# EasyEDA schematic SCH_Endurance_drone_5.json
TITLE: Drone main PCB (No MUX); REV: 2; Date: 2021-11-16; Sheet: 1/1; Company: Endurance
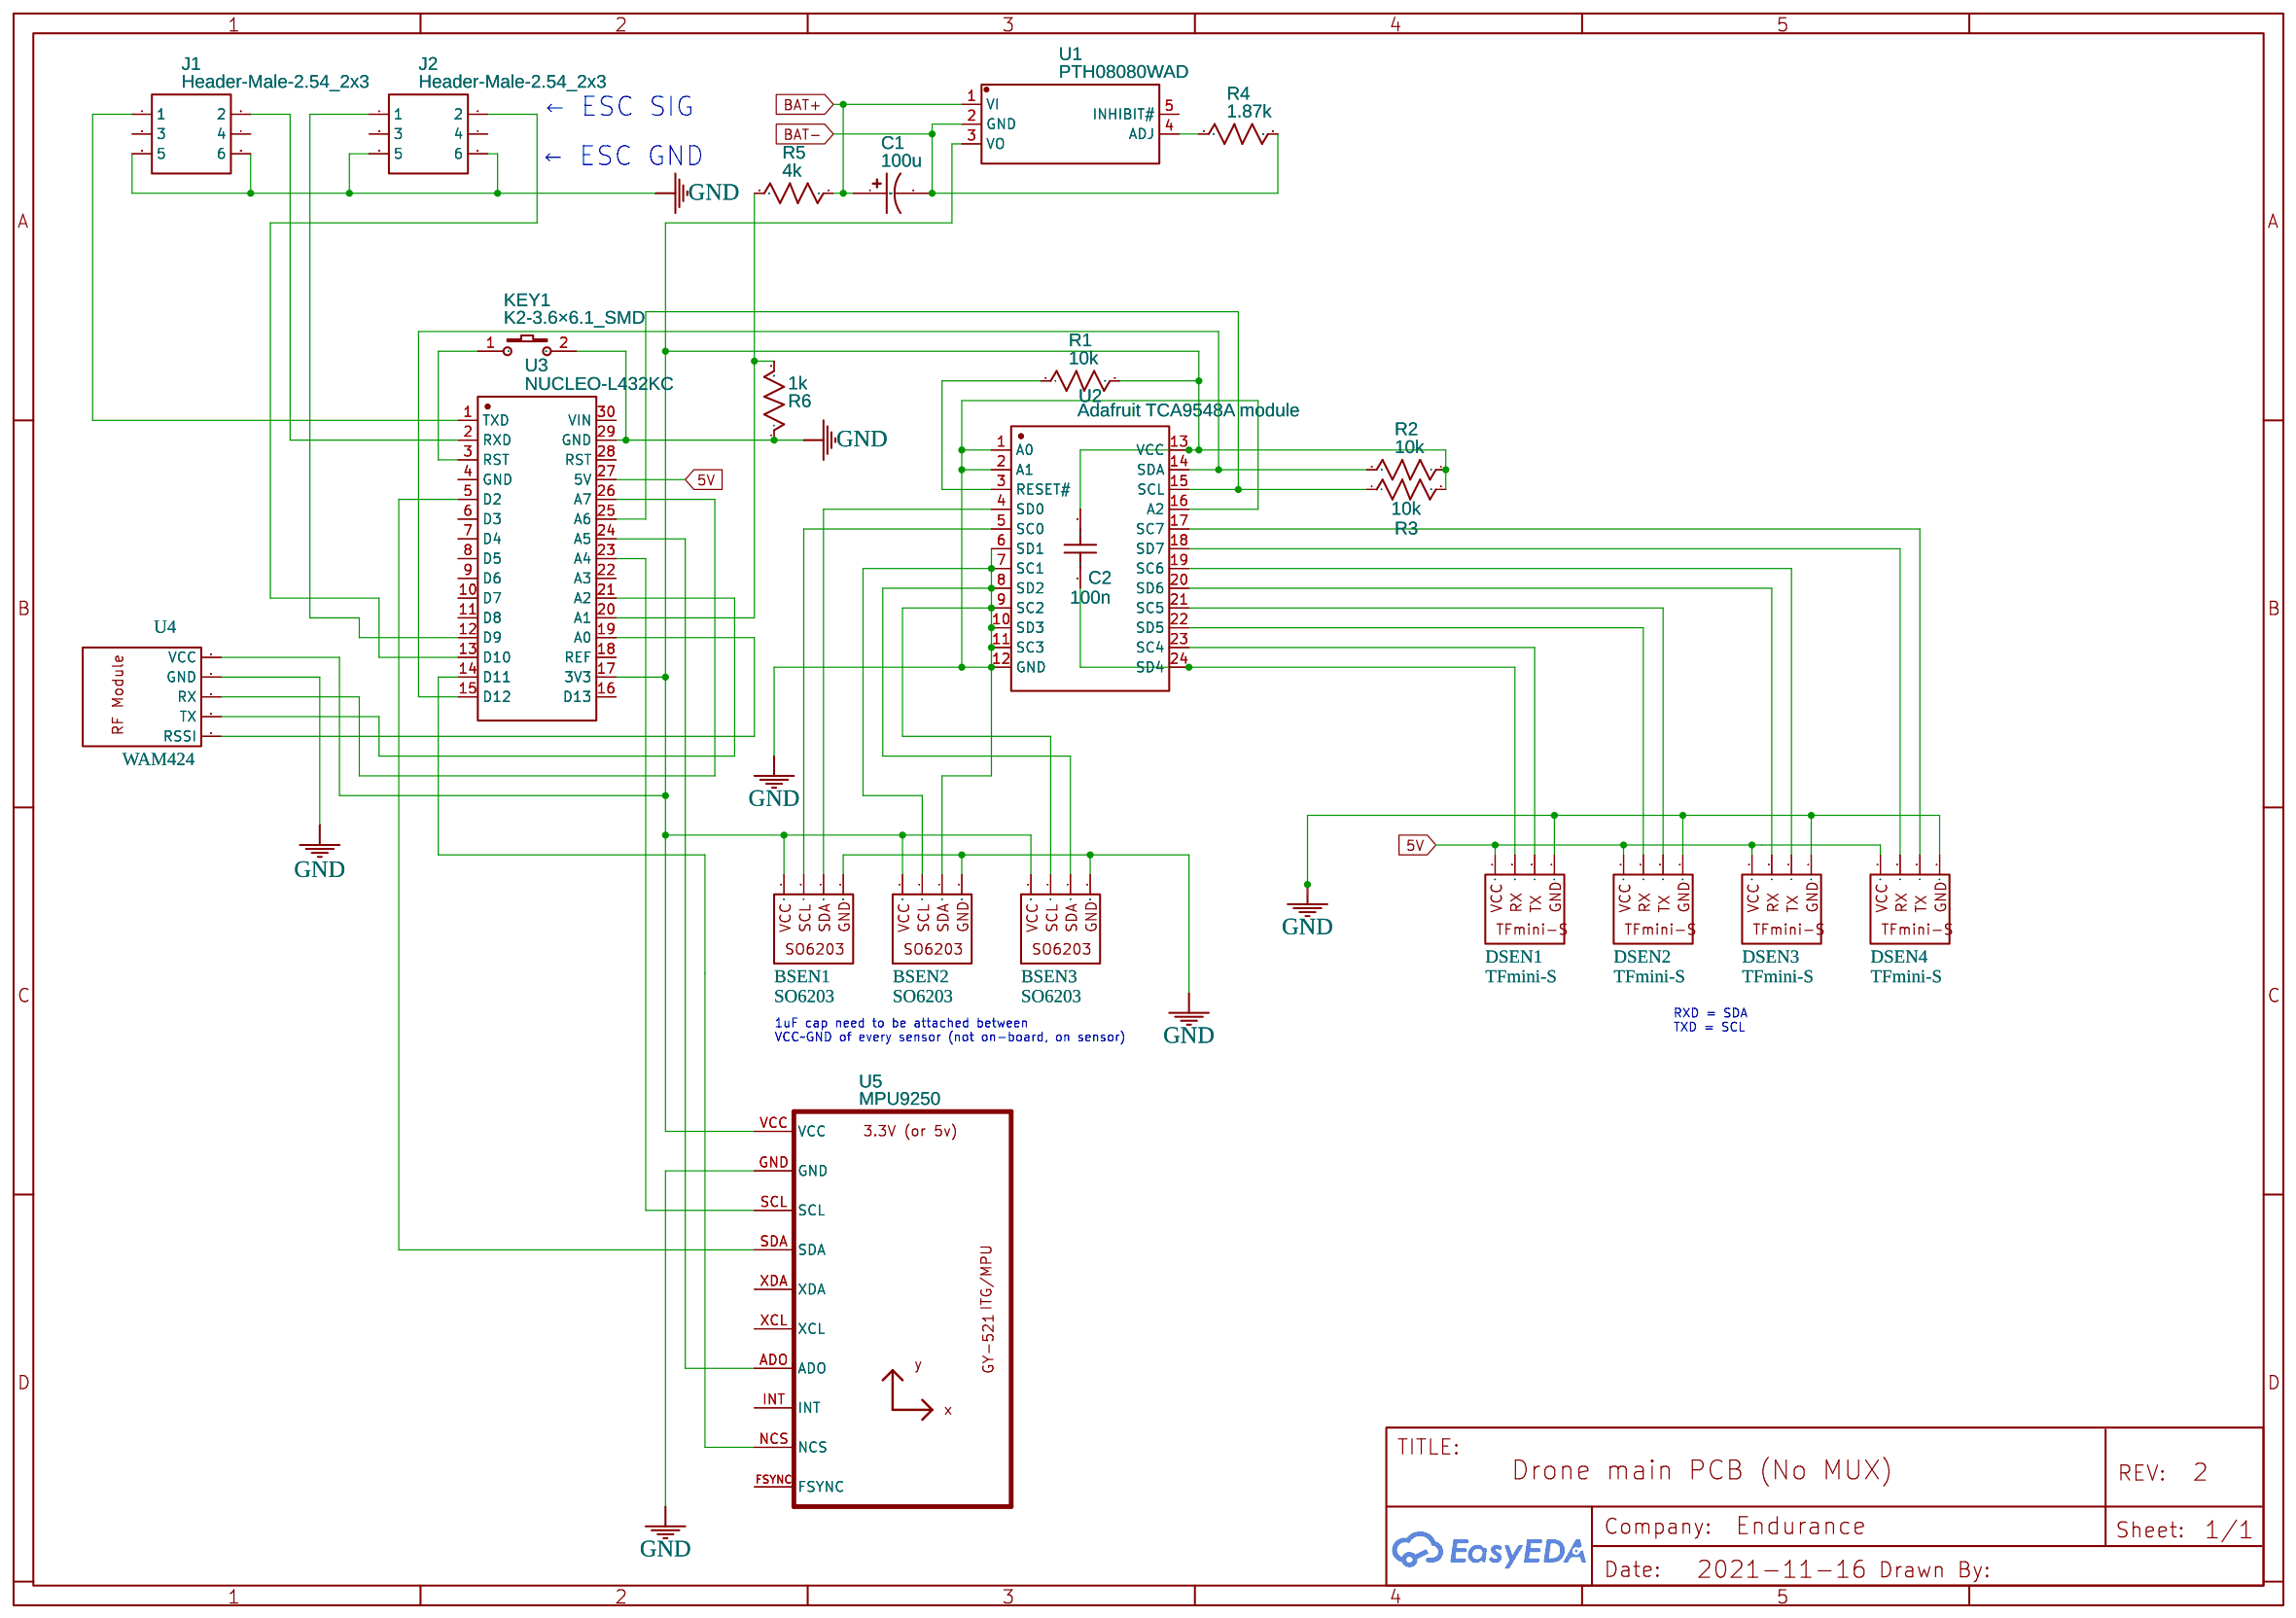
[diagram p0: schematic sheet]

## Parts
BSEN1  SO6203  [MOLEX_SPOX-5267_22-03-5045_04X2.54MM_STRAIGHT]
BSEN2  SO6203  [MOLEX_SPOX-5267_22-03-5045_04X2.54MM_STRAIGHT]
BSEN3  SO6203  [MOLEX_SPOX-5267_22-03-5045_04X2.54MM_STRAIGHT]
C1  100u  [CASE-A_3216]
C2  100n  [C0603]
DSEN1  TFmini-S  [MOLEX_SPOX-5267_22-03-5045_04X2.54MM_STRAIGHT]
DSEN2  TFmini-S  [MOLEX_SPOX-5267_22-03-5045_04X2.54MM_STRAIGHT]
DSEN3  TFmini-S  [MOLEX_SPOX-5267_22-03-5045_04X2.54MM_STRAIGHT]
DSEN4  TFmini-S  [MOLEX_SPOX-5267_22-03-5045_04X2.54MM_STRAIGHT]
J1  Header-Male-2.54_2x3  [HDR-TH_6P-P2.54-V-M-R2-C3-S2.54-1]
J2  Header-Male-2.54_2x3  [HDR-TH_6P-P2.54-V-M-R2-C3-S2.54-1]
KEY1  K2-3.6×6.1_SMD  [KEY-SMD_2P-L6.2-W3.6-LS8.0]
R1  10k  [R0603]
R2  10k  [R0603]
R3  10k  [R0603]
R4  1.87k  [R0805]
R5  4k  [R0603]
R6  1k  [R0603]
U1  PTH08080WAD  [PWRM-TH_5P-L16.3-W13.7-P3.56]
U2  Adafruit TCA9548A module  [TCA9548A]
U3  NUCLEO-L432KC  [DIP-30_L51.0-W17.8-P2.54-LS15.2-TL]
U4  WAM424  [MOLEX_SPOX-5267_22-03-5045_04X2.54MM_STRAIGHT]
U5  MPU9250  [GY-521]

## Library data of the parts
C1 = C_Tan_SMD_A_US: Contributor: LCEDA_Lib
C2 = C_0603_US: Contributor: LCEDA_Lib
J1 J2 = Header-Male-2.54_2x3: Supplier: LCSC; Manufacturer: BOOMELE; Supplier Part: C65114; JLCPCB Part Class: Extended Part
KEY1 = K2-3.6×6.1_SMD: Supplier Part: C118141; Supplier: LCSC; Manufacturer Part: K2-1107ST-A4SW-06; Contributor: LCEDA_Lib; 制造商: 韩国韩荣
R1-R6 = R_0603_US: Contributor: LCEDA_Lib
U1 = PTH08080WAD: Supplier: LCSC; Supplier Part: C154927; Manufacturer: Texas Instruments; Contributor: LCSC; JLCPCB Part Class: Extended Part
U2 = TCA9548APWR: Supplier: LCSC; Manufacturer: TI; Supplier Part: C130026; JLCPCB Part Class: Extended Part; Package Display: No
U3 = NUCLEO-L432KC: Supplier: LCSC; Manufacturer: STMicroelectronics; Supplier Part: C94814; JLCPCB Part Class: Extended Part
U5 = MPU9250: Contributor: StefMas

## Nets
5V: BSEN1.1 BSEN2.1 BSEN3.1 C2.1 C2.2 DSEN1.1 DSEN2.1 DSEN3.1 DSEN4.1 J1.5 J1.6 J2.5 J2.6 KEY1.2 R1.2 R2.1 R3.2 R6.1 U1.3(VO) U2.1(A0) U2.2(A1) U2.4(SD0) U2.5(SC0) U2.6(SD1) U2.7(SC1) U2.8(SD2) U2.9(SC2) U2.10(SD3) U2.11(SC3) U2.12(GND) U2.13(VCC) U2.16(A2) U2.17(SC7) U2.18(SD7) U2.19(SC6) U2.20(SD6) U2.21(SC5) U2.22(SD5) U2.23(SC4) U2.24(SD4) U3.17(3V3) U3.19(A0) U3.21(A2) U3.26(A7) U3.27(5V) U3.29(GND) U4.3(VCC) U5.GND U5.VCC
BAT+: C1.1 R5.1 U1.1(VI)
BAT-: C1.2 R4.2 U1.2(GND)
Net-(J1-1): J1.1 U3.1(TXD)
Net-(J1-2): J1.2 U3.2(RXD)
Net-(J2-1): J2.1 U3.12(D9)
Net-(J2-2): J2.2 U3.13(D10)
Net-(KEY1-1): KEY1.1 U3.3(RST)
Net-(R1-1): R1.1 U2.3(RESET#)
Net-(R2-2): R2.2 U2.14(SDA) U3.15(D12)
Net-(R3-1): R3.1 U2.15(SCL) U3.25(A6)
Net-(R4-1): R4.1 U1.4(ADJ)
Net-(R5-2): R5.2 R6.2 U3.20(A1)
Net-(U3-5): U3.5(D2) U5.SDA
Net-(U3-14): U3.14(D11) U5.NCS
Net-(U3-23): U3.23(A4) U5.SCL
Net-(U3-24): U3.24(A5) U5.ADO

Not connected (* = marked no-connect by the designer): J1 3 4; J2 3 4; U1 5(INHIBIT#); U3 4(GND) 6(D3) 7(D4) 8(D5) 9(D6) 10(D7) 11(D8) 16(D13) 18(REF) 22(A3) 28(RST) 30(VIN); U5 FSYNC INT XCL XDA

## Notes on the sheet
- ← ESC SIG
- ← ESC GND
- 1uF cap need to be attached between
  VCC~GND of every sensor (not on-board, on sensor)
- RXD = SDA
  TXD = SCL
- 김정현
